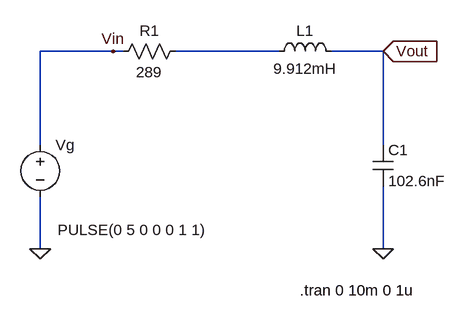
[diagram p0: schematic Draft1.asc]
Draft1.asc, the LTspice schematic file:
Version 4
SHEET 1 880 680
WIRE 240 160 128 160
WIRE 256 160 240 160
WIRE 496 160 336 160
WIRE 656 160 576 160
WIRE 128 304 128 160
WIRE 656 304 656 160
WIRE 128 464 128 384
WIRE 656 464 656 368
FLAG 128 464 0
FLAG 656 464 0
FLAG 240 160 Vin
FLAG 656 160 Vout
IOPIN 656 160 In
SYMBOL Ind 480 176 R270
WINDOW 0 32 56 VTop 2
WINDOW 3 5 56 VBottom 2
SYMATTR InstName L1
SYMATTR Value 9.912mH
SYMBOL Cap 640 304 R0
SYMATTR InstName C1
SYMATTR Value 102.6nF
SYMBOL Res 352 144 R90
WINDOW 0 0 56 VBottom 2
WINDOW 3 32 56 VTop 2
SYMATTR InstName R1
SYMATTR Value 289
SYMBOL Voltage 128 288 R0
WINDOW 3 27 147 Left 2
SYMATTR Value PULSE(0 5 0 0 0 1 1)
SYMATTR InstName Vg
TEXT 528 528 Left 2 !.tran 0 10m 0 1u

The netlist it stands for:
* Draft1.asc
L1 N001 Vout 9.912mH
C1 Vout 0 102.6nF
R1 N001 Vin 289
Vg Vin 0 PULSE(0 5 0 0 0 1 1)
.tran 0 10m 0 1u
.backanno
.end